# Altium schematic sheet 01-SOM.SchDoc
size A3
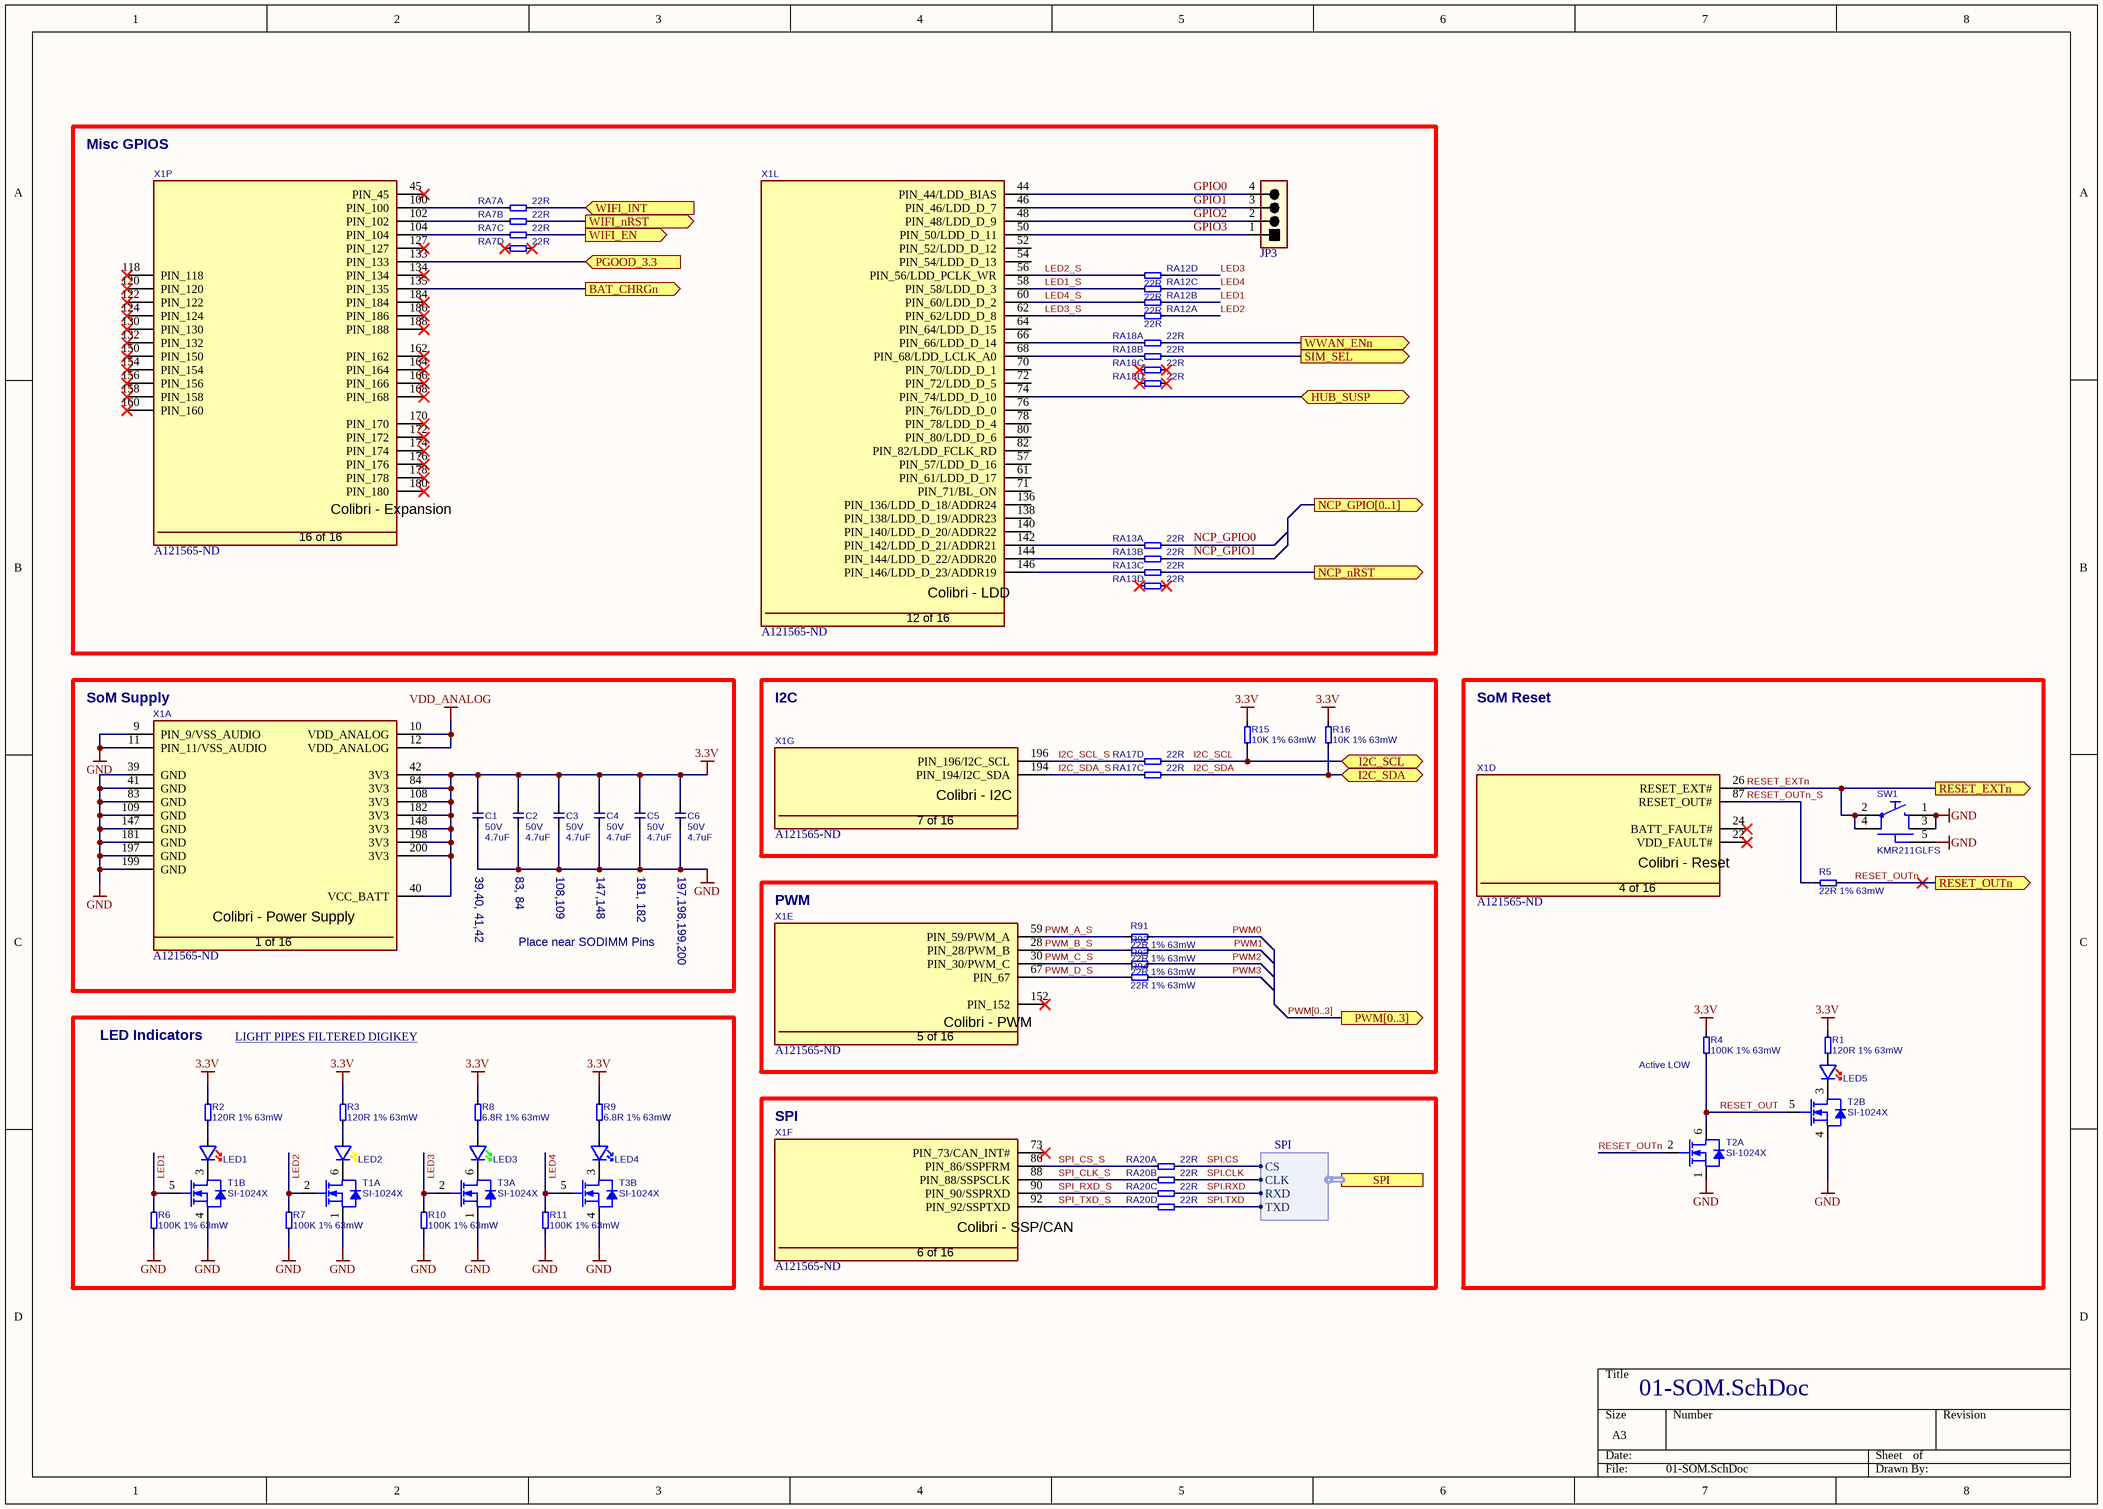
[diagram p0: 01-SOM.SchDoc]

## Parts
C1  value 4.7uF  Rating: 50V  [T_CAPC1206X180N]  (hidden comment: 4.7uF 50V 20% X7R)
C2  value 4.7uF  Rating: 50V  [T_CAPC1206X180N]  (hidden comment: 4.7uF 50V 20% X7R)
C3  value 4.7uF  Rating: 50V  [T_CAPC1206X180N]  (hidden comment: 4.7uF 50V 20% X7R)
C4  value 4.7uF  Rating: 50V  [T_CAPC1206X180N]  (hidden comment: 4.7uF 50V 20% X7R)
C5  value 4.7uF  Rating: 50V  [T_CAPC1206X180N]  (hidden comment: 4.7uF 50V 20% X7R)
C6  value 4.7uF  Rating: 50V  [T_CAPC1206X180N]  (hidden comment: 4.7uF 50V 20% X7R)
JP3  61300411121  [Header 1x4, 2.54mm pitch, male]  (value not drawn)
LED1  150060RS75000  [LEDC1608X80N]  (value not drawn)
LED2  150060YS75000  [LEDC1608X80N]  (value not drawn)
LED3  150060GS75000  [LEDC1608X80N]  (value not drawn)
LED4  150060BS75000  [LEDC1608X80N]  (value not drawn)
LED5  150060RS75000  [LEDC1608X80N]  (value not drawn)
R1  120R 1% 63mW  [RESC1005X40N]
R2  120R 1% 63mW  [RESC1005X40N]
R3  120R 1% 63mW  [RESC1005X40N]
R4  100K 1% 63mW  [RESC1005X40N]
R5  22R 1% 63mW  [RESC1005X40N]
R6  100K 1% 63mW  [RESC1005X40N]
R7  100K 1% 63mW  [RESC1005X40N]
R8  6.8R 1% 63mW  [RESC1005X40N]
R9  6.8R 1% 63mW  [RESC1005X40N]
R10  100K 1% 63mW  [RESC1005X40N]
R11  100K 1% 63mW  [RESC1005X40N]
R15  10K 1% 63mW  [RESC1005X40N]
R16  10K 1% 63mW  [RESC1005X40N]
R91  22R 1% 63mW  [RESC1005X40N]
R92  22R 1% 63mW  [RESC1005X40N]
R93  22R 1% 63mW  [RESC1005X40N]
R94  22R 1% 63mW  [RESC1005X40N]
RA7  22R  [T_Resistor_Array_X4]  (parts A,B,C,D of 4)
RA12  22R  [T_Resistor_Array_X4]  (parts A,B,C,D of 4)
RA13  22R  [T_Resistor_Array_X4]  (parts A,B,C,D of 4)
RA17  22R  [T_Resistor_Array_X4]  (parts C,D of 4)
RA18  22R  [T_Resistor_Array_X4]  (parts A,B,C,D of 4)
RA20  22R  [T_Resistor_Array_X4]  (parts A,B,C,D of 4)
SW1  KMR211GLFS  [T_CnK_KMR211GLFS]
T1  SI-1024X  [SOTFL50P160X60-6N]  (parts A,B of 2)
T2  SI-1024X  [SOTFL50P160X60-6N]  (parts A,B of 2)
T3  SI-1024X  [SOTFL50P160X60-6N]  (parts A,B of 2)
X1  Supplier Part Number 1: A121565-ND  [T_Tyco_1473005-1]  (hidden comment: 1473005-1)  (parts A,D,E,F,G,L,P of 16)

## Blocks framed on the sheet
Misc GPIOS: JP3 RA7 RA12 RA13 RA18 X1
SoM Supply: C1-C6 X1
I2C: R15 R16 RA17 X1
SoM Reset: LED5 R1 R4 R5 SW1 T2 X1
PWM: R91-R94 X1
LED Indicators: LED1-LED4 R2 R3 R6-R11 T1 T3
SPI: RA20 X1

## Ports
BAT_CHRGn (out), HUB_SUSP (bidir), I2C_SCL (bidir), I2C_SDA (bidir), NCP_GPIO[0..1] (out), NCP_nRST (out), PGOOD_3.3 (in), PWM[0..3] (out), RESET_EXTn (out), RESET_OUTn (out), SIM_SEL (out), SPI (harness SPI), WIFI_EN (out), WIFI_INT (in), WIFI_nRST (out), WWAN_ENn (out)

## Harnesses
SPI: CS, CLK, RXD, TXD

## Nets
3.3V: C1.2 C2.2 C3.2 C4.2 C5.2 C6.2 R1.2 R2.1 R3.1 R4.2 R8.1 R9.1 R15.2 R16.2 X1.40(VCC_BATT) X1.42(3V3) X1.84(3V3) X1.108(3V3) X1.148(3V3) X1.182(3V3) X1.198(3V3) X1.200(3V3)
GND: C1.1 C2.1 C3.1 C4.1 C5.1 C6.1 R6.2 R7.2 R10.2 R11.2 SW1.1 SW1.3 SW1.5 T1.1(S) T1.4(S) T2.1(S) T2.4(S) T3.1(S) T3.4(S) X1.9(PIN_9/VSS_AUDIO) X1.11(PIN_11/VSS_AUDIO) X1.39(GND) X1.41(GND) X1.83(GND) X1.109(GND) X1.147(GND) X1.181(GND) X1.197(GND) X1.199(GND)
VDD_ANALOG: X1.10(VDD_ANALOG) X1.12(VDD_ANALOG)
BAT_CHRGn: X1.135(PIN_135) ; port BAT_CHRGn
GPIO0: JP3.4 X1.44(PIN_44/LDD_BIAS)
GPIO1: JP3.3 X1.46(PIN_46/LDD_D_7)
GPIO2: JP3.2 X1.48(PIN_48/LDD_D_9)
GPIO3: JP3.1 X1.50(PIN_50/LDD_D_11)
HUB_SUSP: X1.74(PIN_74/LDD_D_10) ; port HUB_SUSP
I2C_SCL: R15.1 RA17.8 ; port I2C_SCL
I2C_SCL_S: RA17.4 X1.196(PIN_196/I2C_SCL)
I2C_SDA: R16.1 RA17.7 ; port I2C_SDA
I2C_SDA_S: RA17.3 X1.194(PIN_194/I2C_SDA)
LED1: R6.1 RA12.2 T1.5(G)
LED1_S: RA12.7 X1.58(PIN_58/LDD_D_3)
LED2: R7.1 RA12.1 T1.2(G)
LED2_S: RA12.8 X1.56(PIN_56/LDD_PCLK_WR)
LED3: R10.1 RA12.4 T3.2(G)
LED3_S: RA12.5 X1.62(PIN_62/LDD_D_8)
LED4: R11.1 RA12.3 T3.5(G)
LED4_S: RA12.6 X1.60(PIN_60/LDD_D_2)
NCP_GPIO0: RA13.5
NCP_GPIO1: RA13.6
NCP_nRST: RA13.7 ; port NCP_nRST
PGOOD_3.3: X1.133(PIN_133) ; port PGOOD_3.3
PWM0: R91.1
PWM1: R92.1
PWM2: R93.1
PWM3: R94.1
PWM_A_S: R91.2 X1.59(PIN_59/PWM_A)
PWM_B_S: R92.2 X1.28(PIN_28/PWM_B)
PWM_C_S: R93.2 X1.30(PIN_30/PWM_C)
PWM_D_S: R94.2 X1.67(PIN_67)
RESET_EXTn: SW1.2 SW1.4 X1.26(RESET_EXT#) ; port RESET_EXTn
RESET_OUT: R4.1 T2.5(G) T2.6(D)
RESET_OUTn: R5.1 T2.2(G) ; port RESET_OUTn
RESET_OUTn_S: R5.2 X1.87(RESET_OUT#)
SIM_SEL: RA18.6 ; port SIM_SEL
SPI.CLK: RA20.6 ; port SPI.CLK
SPI.CS: RA20.5 ; port SPI.CS
SPI.RXD: RA20.7 ; port SPI.RXD
SPI.TXD: RA20.8 ; port SPI.TXD
SPI_CLK_S: RA20.2 X1.88(PIN_88/SSPSCLK)
SPI_CS_S: RA20.1 X1.86(PIN_86/SSPFRM)
SPI_RXD_S: RA20.3 X1.90(PIN_90/SSPRXD)
SPI_TXD_S: RA20.4 X1.92(PIN_92/SSPTXD)
WIFI_EN: RA7.7 ; port WIFI_EN
WIFI_INT: RA7.5 ; port WIFI_INT
WIFI_nRST: RA7.6 ; port WIFI_nRST
WWAN_ENn: RA18.5 ; port WWAN_ENn
NetLED1_1: LED1.1 T1.3(D)
NetLED1_2: LED1.2 R2.2
NetLED2_1: LED2.1 T1.6(D)
NetLED2_2: LED2.2 R3.2
NetLED3_1: LED3.1 T3.6(D)
NetLED3_2: LED3.2 R8.2
NetLED4_1: LED4.1 T3.3(D)
NetLED4_2: LED4.2 R9.2
NetLED5_1: LED5.1 T2.3(D)
NetLED5_2: LED5.2 R1.1
NetRA7_1: RA7.1 X1.100(PIN_100)
NetRA7_2: RA7.2 X1.102(PIN_102)
NetRA7_3: RA7.3 X1.104(PIN_104)
NetRA13_1: RA13.1 X1.142(PIN_142/LDD_D_21/ADDR21)
NetRA13_2: RA13.2 X1.144(PIN_144/LDD_D_22/ADDR20)
NetRA13_3: RA13.3 X1.146(PIN_146/LDD_D_23/ADDR19)
NetRA18_1: RA18.1 X1.66(PIN_66/LDD_D_14)
NetRA18_2: RA18.2 X1.68(PIN_68/LDD_LCLK_A0)

Not connected (* = marked no-connect by the designer): RA7 4* 8*; RA13 4* 8*; RA18 3* 4* 7* 8*; X1 22(VDD_FAULT#)* 24(BATT_FAULT#)* 45(PIN_45)* 52(PIN_52/LDD_D_12) 54(PIN_54/LDD_D_13) 57(PIN_57/LDD_D_16) 61(PIN_61/LDD_D_17) 64(PIN_64/LDD_D_15) 70(PIN_70/LDD_D_1) 71(PIN_71/BL_ON) 72(PIN_72/LDD_D_5) 73(PIN_73/CAN_INT#)* 76(PIN_76/LDD_D_0) 78(PIN_78/LDD_D_4) 80(PIN_80/LDD_D_6) 82(PIN_82/LDD_FCLK_RD) 118(PIN_118)* 120(PIN_120)* 122(PIN_122)* 124(PIN_124)* 127(PIN_127)* 130(PIN_130)* 132(PIN_132)* 134(PIN_134)* 136(PIN_136/LDD_D_18/ADDR24) 138(PIN_138/LDD_D_19/ADDR23) 140(PIN_140/LDD_D_20/ADDR22) 150(PIN_150)* 152(PIN_152)* 154(PIN_154)* 156(PIN_156)* 158(PIN_158)* 160(PIN_160)* 162(PIN_162)* 164(PIN_164)* 166(PIN_166)* 168(PIN_168)* 170(PIN_170)* 172(PIN_172)* 174(PIN_174)* 176(PIN_176)* 178(PIN_178)* 180(PIN_180)* 184(PIN_184)* 186(PIN_186)* 188(PIN_188)*

## Buses and harness runs
bus PWM[0..3] = port PWM[0..3]

## Notes on the sheet
- 39,40, 41,42
- 83, 84
- 108,109
- 147,148
- 181, 182
- 197,198,199,200
- Place near SODIMM Pins
- LIGHT PIPES FILTERED DIGIKEY <https://www.digikey.com/products/en/optoelectronics/optics-light-pipes/102?k=light+pipes&k=&pkeyword=light+pipes&sv=0&pv2029=170365&pv2029=202209&sf=1&FV=37%7C330893%2C37%7C330951%2C-8%7C102%2C2028%7C398078&quantity=&ColumnSort=1000011&page=1&stock=1&nstock=1&pageSize=250>
- (near R4) Active LOW
- (in symbol CON-Tyco-1473005-1-200-0.6mm, part A) Colibri - Power Supply; 1 of 16
- (in symbol CON-Tyco-1473005-1-200-0.6mm, part D) Colibri - Reset; 4 of 16
- (in symbol CON-Tyco-1473005-1-200-0.6mm, part E) Colibri - PWM; 5 of 16
- (in symbol CON-Tyco-1473005-1-200-0.6mm, part F) Colibri - SSP/CAN; 6 of 16
- (in symbol CON-Tyco-1473005-1-200-0.6mm, part G) Colibri - I2C; 7 of 16
- (in symbol CON-Tyco-1473005-1-200-0.6mm, part L) Colibri - LDD; 12 of 16
- (in symbol CON-Tyco-1473005-1-200-0.6mm, part P) Colibri - Expansion; 16 of 16

## Library data of the parts
C1-C6 = C-4.7uF-50V-20%-1210: Capacitor Ceramic X7R 4.7uF 50V 20% 1206; Tolerance: 10%; FP_DESC: C1206; Type: X7R; Supplier 1: Digi-Key; Supplier Part Number 1: 1276-2789-1-ND; MFG: *; MFG_PN: *
JP3 = Header 1x4: Header male, 1x4 Pins, 2.54 mm pitch; No. of ways: 1x2; Pitch: 2.54 mm; MFG: Würth Elektronik; Footprint Checked: -; MFG_PN: 61300411121; Symbol Checked: -; Supplier 1: Digi-Key; Supplier Part Number 1: 732-5317-ND
LED1 LED5 = LED-RED-0603: Red 625nm LED Indication - Discrete 2V 0603 (1608 Metric); MFG: Würth Elektronik; MFG_PN: 150060RS75000; Color: Red; Supplier 1: Digi-Key; Supplier Part Number 1: 732-4978-1-ND; Footprint Checked: -; Symbol Checked: -
LED2 = LED-YELLOW-0603: Yellow 590nm LED Indication - Discrete 2V 0603 (1608 Metric); MFG: Würth Elektronik; MFG_PN: 150060YS75000; Color: Yellow; Supplier 1: Digi-Key; Supplier Part Number 1: 732-4981-1-ND; Footprint Checked: -; Symbol Checked: -
LED3 = LED-GREEN-0603: Green 520nm LED Indication - Discrete 3.2V 0603 (1608 Metric); MFG: Würth Elektronik; MFG_PN: 150060GS75000; Color: Green; Supplier 1: Digi-Key; Supplier Part Number 1: 732-4971-1-ND; Footprint Checked: -; Symbol Checked: -
LED4 = LED-BLUE-0603: Blue 470nm LED Indication - Discrete 3.2V 0603 (1608 Metric); MFG: Würth Elektronik; MFG_PN: 150060BS75000; Color: Blue; Supplier 1: Digi-Key; Supplier Part Number 1: 732-4966-1-ND; Footprint Checked: -; Symbol Checked: -
R1-R3 = R-120R-1%-0402: Resistor 120ohm 63mW 1% 0402; MFG: <GENERIC>; Power: 63mW; Tolerance: 1%; Footprint: R0402; Value: 120R; Supplier 1: Digi-Key; Supplier Part Number 1: 541-120LCT-ND; Footprint Checked: -; Symbol Checked: -; MFG_PN: <GENERIC>
R4 R6 R7 R10 R11 = R-100K-1%-0402: Resistor 100Kohm 63mW 1% 0402; Manufacturer: <GENERIC>; Replacement Allowed: Yes; Power: 63mW; Tolerance: 1%; Value: 100k; Footprint: R0402; Supplier 1: Digi-Key; Supplier Part Number 1: 541-100KLCT-ND; Manufacturer Part Number: <GENERIC>
R5 R91-R94 = R-22R-1%-0402: Resistor 22ohm 63mW 1% 0402; Value: 22; MFG: <GENERIC>; Power: 63mW; Tolerance: 1%; Footprint: R0402; Supplier 1: Digi-Key; Supplier Part Number 1: 541-22.0LCT-ND; Footprint Checked: -; Symbol Checked: -; MFG_PN: <GENERIC>
R8 R9 = R-6.8R-1%-0402: Resistor 6.8ohm 63mW 1% 0402; Manufacturer: <GENERIC>; Replacement Allowed: Yes; Power: 63mW; Tolerance: 1%; Footprint: R0402; Value: 6.8R; Supplier 1: Digi-Key; Supplier Part Number 1: 541-68.0LCT-ND; Manufacturer Part Number: <GENERIC>
R15 R16 = R-10K-1%-0402: Resistor 10Kohm 63mW 1% 0402; MFG: <GENERIC>; Power: 63mW; Tolerance: 1%; Value: 10k; Footprint: R0402; Supplier 1: Digi-Key; Supplier Part Number 1: 541-10.0KLDKR-ND; Footprint Checked: -; Symbol Checked: -; MFG_PN: <GENERIC>
RA7 RA12 RA13 RA17 RA18 RA20 = RA-22R-5%-1206-div: Resistor Array 22 R 63mW 5% 1206; MFG: Generic; Tolerance: 5%; Value: 22R; Power Dissipation: 63mW; Supplier 1: Digi-Key; Supplier Part Number 1: TC164J-22CT-ND; Footprint Checked: -; Symbol Checked: -
SW1 = SW-KMR211GLFS-1VA: Power ON Switch; Rating: 1VA; MFG: C&N; Supplier 1: Digi-Key; Supplier Part Number 1: 401-1426-1-ND; Footprint Checked: -; Symbol Checked: -; MFG_PN: KMR211GLFS
T1-T3 = T-Vishay-SI-1024X: Mosfet Array 2 N-Channel (Dual) 20V 485mA 250mW Surface Mount SC-89-6; MFG: Vishay; MFG_PN: SI-1024-X; Supplier 1: Digi-Key; Supplier Part Number 1: SI1024X-T1-GE3CT-ND; Footprint Checked: -; Symbol Checked: -
X1 = CON-Tyco-1473005-1-200-0.6mm: SODIMM Connector; Manufacturer Name: Tyco; No. of ways: 200; Supplier 1: Digi-Key; Manufacturer Part No.: 1473005-1